# Altium schematic sheet Sheet-nilm1.SchDoc
size A4
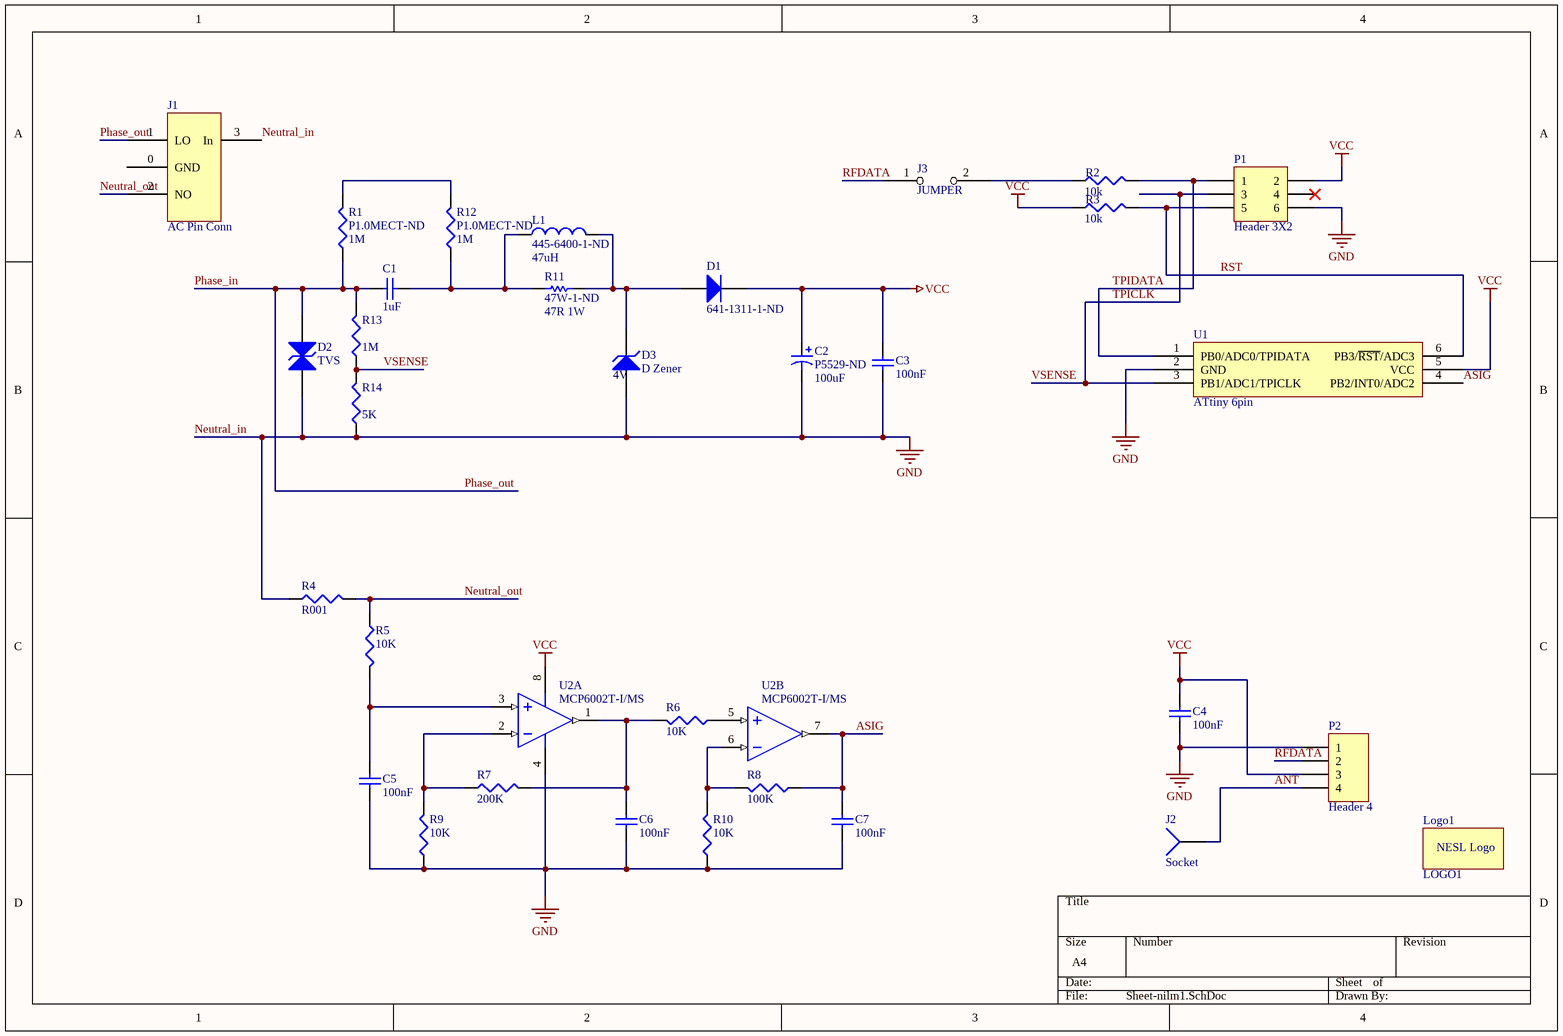
[diagram p0: Sheet-nilm1.SchDoc]

## Parts
C1  1uF  [CAP-22.5mm]
C2  P5529-ND  value 100uF  [CAPPR2-5x6.8]
C3  100nF  [CAPC1608L]
C4  100nF  [CAPC1608L]
C5  100nF  [CAPC1608L]
C6  100nF  [CAPC1608L]
C7  100nF  [CAPC1608L]
D1  641-1311-1-ND  [DIO9.2-4.1x2.5]
D2  TVS  [CD4532-1812]
D3  D Zener  value 4V  [SOD123/X.85]
J1  AC Pin Conn  [AC_PLUG]
J2  Socket  [PIN1]
J3  JUMPER  [HDR1X2]
L1  445-6400-1-ND  value 47uH  [INDC2012L]
Logo1  LOGO1  [NESL_logo]
P1  Header 3X2  [6-pin 2mm]
P2  Header 4  [HDR1X4]
R1  P1.0MECT-ND  value 1M  [RESC3216L]
R2  10k  [RESC1608L]
R3  10k  [RESC1608L]
R4  R001  [RESC6332L]
R5  10K  [RESC1608L]
R6  10K  [RESC1608L]
R7  200K  [RESC1608L]
R8  100K  [RESC1608L]
R9  10K  [RESC1608L]
R10  10K  [RESC1608L]
R11  47W-1-ND  value 47R 1W  [RES45x115VERT]
R12  P1.0MECT-ND  value 1M  [RESC3216L]
R13  value 1M  [RESC3216L]
R14  value 5K  [RESC3216L]
U1  ATtiny 6pin  [SOT23-6M]
U2  MCP6002T-I/MS  [MSOP65P-8N]  (parts A,B of 2)

## Nets
Neutral_in: C2.2 C3.1 C4.1 C5.1 C6.1 C7.1 D2.1(A) D3.1(A) J1.3(In) P1.6 P2.1 R4.1 R9.1 R10.1 R14.1 U1.2(GND) U2.4(V-)  [also labelled GND]
VCC: C2.1 C3.2 C4.2 D1.2(K) P1.2 P2.3 R3.1 U1.5(VCC) U2.8(V+)
ANT: J2.1 P2.4
ASIG: C7.2 R8.1 U1.4(PB2/INT0/ADC2) U2.7(OUT)
Neutral_out: J1.2(NO) R4.2 R5.1
Phase_in: C1.1 D2.2(K) J1.1(LO) R1.1 R13.2  [also labelled Phase_out]
RFDATA: J3.1 P2.2
RST: P1.5 R3.2 U1.6(PB3/~{RST}/ADC3)
TPICLK: P1.3 R13.1 R14.2 U1.3(PB1/ADC1/TPICLK)  [also labelled VSENSE]
TPIDATA: P1.1 R2.2 U1.1(PB0/ADC0/TPIDATA)
NetC1_2: C1.2 L1.1 R11.1 R12.1
NetC5_2: C5.2 R5.2 U2.3(IN+)
NetC6_2: C6.2 R6.2 R7.2 U2.1(OUT)
NetD1_1: D1.1(A) D3.2(K) L1.2 R11.2
NetJ3_2: J3.2 R2.1
NetR1_2: R1.2 R12.2
NetR6_1: R6.1 U2.5(IN+)
NetR7_1: R7.1 R9.2 U2.2(IN-)
NetR8_2: R8.2 R10.2 U2.6(IN-)

Not connected (* = marked no-connect by the designer): J1 0(GND); P1 4*

## Notes on the sheet
- (in symbol 2447) NESL Logo

## Library data of the parts
C1 = Cap: Capacitor; Published: 8-Jun-2000; LatestRevisionDate: 17-Jul-2002; LatestRevisionNote: Re-released for DXP Platform.; PackageReference: RAD-0.3; Publisher: Altium Limited; Value: 1uF
C2 = Cap Pol3: Polarized Capacitor (Surface Mount); Published: 8-Jun-2000; LatestRevisionDate: 29-May-2009; LatestRevisionNote: IPC-7351 Footprint Added.; PackageReference: C0805; Publisher: Altium Limited; PackageDescription: Chip Capacitor
C3-C7 = Cap Semi: Capacitor (Semiconductor SIM Model); Published: 8-Jun-2000; LatestRevisionDate: 29-May-2009; LatestRevisionNote: IPC-7351 Footprint Added.; PackageReference: C1206; Publisher: Altium Limited; PackageDescription: Chip Capacitor; Value: 100nF
D1 = Diode: Default Diode; Published: 8-Jun-2000; LatestRevisionDate: 17-Jul-2002; LatestRevisionNote: Re-released for DXP Platform.; PackageVersion: Sep-1996; PackageReference: SMC; Publisher: Altium Limited; Code_JEDEC: DO-214-AB
D3 = D Zener: MMSZ5229BFSCT-ND; Published: 8-Jun-2000; LatestRevisionDate: 17-Jul-2002; LatestRevisionNote: Re-released for DXP Platform.; PackageReference: DIODE-0.7; Publisher: Altium Limited
J1 = AC_Plug
L1 = Inductor: Code_IEC: 1005; Published: 8-Jun-2000; LatestRevisionDate: 29-May-2009; LatestRevisionNote: IPC-7351 Footprint Added.; PackageReference: 0402-A; Publisher: Altium Limited; PackageDescription: Chip Inductor; Code_JEITA: 0402
Logo1 = 2447: NESL LOGO COPPER SMALL; Extra_Description: 270x100mil NESL logo, tinned copper; Obsolete: False; Temp_Max: 0; TypeNotes: Applies to all parts in the database; PartID: 2447; mfrName: NESL; mfrPartNum: LOGO1; mfrWebsite: http://nesl.ee.ucla.edu/; URL_Image: http://nesl.ee.ucla.edu/fw/tianji/nesllogo.png; URL_Datasheet: http://; Date_Created: 2011/9/15 0:18:18; Date_LastModified: 2011/9/15 0:18:18; Verified: False; RoHS: True; Temp_Min: 0; Type: All Parts
P1 = Header 3X2: Header, 3-Pin, Dual row; LatestRevisionDate: 17-Jul-2002; LatestRevisionNote: Re-released for DXP Platform.; Publisher: Altium Limited
P2 = Header 4: Header, 4-Pin; LatestRevisionDate: 17-Jul-2002; LatestRevisionNote: Re-released for DXP Platform.; Publisher: Altium Limited
R1-R10 R12-R14 = Res3: Resistor; Published: 8-Jun-2000; LatestRevisionDate: 29-May-2009; LatestRevisionNote: IPC-7351 Footprint Added.; PackageReference: J1-0603; Publisher: Altium Limited; PackageDescription: Chip Resistor
  R2 R3: Value: 10k
  R4: Value: R001
  R5 R6 R9 R10: Value: 10K
  R7: Value: 200K
  R8: Value: 100K
R11 = Res1: Resistor; Published: 8-Jun-2000; LatestRevisionDate: 17-Jul-2002; LatestRevisionNote: Re-released for DXP Platform.; PackageReference: AXIAL-0.3; Publisher: Altium Limited
U1 = ATtiny4/5/9/10
U2 = 2484: mcp6002 series 6 v 1 mhz smt low; mfrName: MICROCHIP; Extra_Description: IC, OP-AMP, 1MHz, 0.6V/µs, 4.5mV, 8-MSOP; Op Amp Type:Low Power; No. of Amplifiers:2; Bandwidth:1MHz; Slew Rate:0.6V/µs; Supply Voltage Range:1.8V to 6V; Amplifier Case Style:MSOP; No. of Pins:8 ;RoHS Compliant: Yes / Mounting Type: ``Surface Mount`` / Case / Package / Footprint: ``MSOP-8`` / Lead-Free Status: ``Lead Free`` / RoHS: ``Compliant`` / Gain Bandwidth Product: { / ``uncertainty_minus``: null, / ``value``: 1000000.0, / ``uncertainty_plus``: null / } / Slew Rate: { / ``uncertainty_minus``: null, / ``value``: 0.6, / ``uncertainty_plus``: null / } / Number of Channels: 2 / Number of Circuits: 2 / Number of Pins: 8; Obsolete: False; Temp_Max: 0; TypeNotes: Applies to all parts in the database; PartID: 2484; mfrPartNum: MCP6002T-I/MS; URL_Image: http://cdn.sigma.octopart.com/9542269/image/Microchip-MCP6002T-I/MS.jpg; URL_Datasheet: http://datasheet.octopart.com/MCP6002T-I/MS-Microchip-datasheet-1384.pdf; Date_Created: 11/23/2011 10:09:53 PM; Date_LastModified: 11/23/2011 10:09:53 PM; Verified: False; RoHS: True; Temp_Min: 0; Type: All Parts
D2 = TVS: Published: 8-Jun-2000; LatestRevisionDate: 17-Jul-2002; LatestRevisionNote: Re-released for DXP Platform.; PackageVersion: Sep-1996; PackageReference: SMC; Publisher: Altium Limited; Code_JEDEC: DO-214-AB
J2 = Socket: LatestRevisionDate: 17-Jul-2002; LatestRevisionNote: Re-released for DXP Platform.; Publisher: Altium Limited